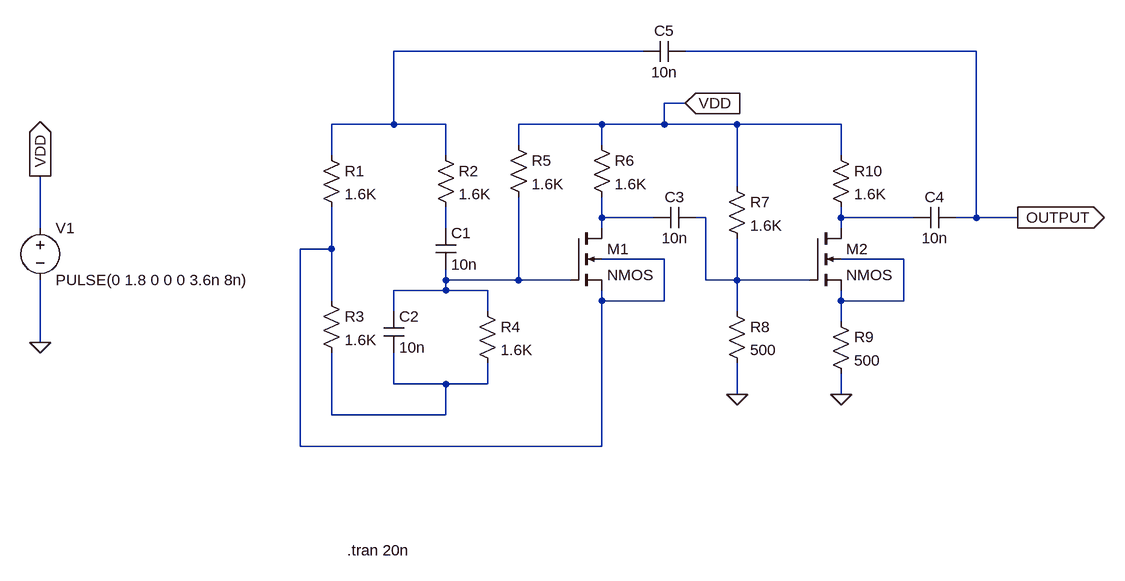
[diagram p0: schematic wein_osc.asc]
wein_osc.asc, the LTspice schematic file:
Version 4
SHEET 1 924 784
WIRE 192 0 -192 0
WIRE 704 0 256 0
WIRE 256 80 224 80
WIRE -192 112 -192 0
WIRE -192 112 -288 112
WIRE -112 112 -192 112
WIRE 128 112 0 112
WIRE 224 112 224 80
WIRE 224 112 128 112
WIRE 336 112 224 112
WIRE 496 112 336 112
WIRE 0 144 0 112
WIRE 128 144 128 112
WIRE -288 160 -288 112
WIRE -112 160 -112 112
WIRE 496 160 496 112
WIRE 336 208 336 112
WIRE 128 256 128 224
WIRE 208 256 128 256
WIRE 288 256 272 256
WIRE 496 256 496 240
WIRE 608 256 496 256
WIRE 704 256 704 0
WIRE 704 256 672 256
WIRE 768 256 704 256
WIRE -736 272 -736 192
WIRE -112 272 -112 240
WIRE 128 272 128 256
WIRE 496 272 496 256
WIRE -288 304 -288 240
WIRE -288 304 -336 304
WIRE 224 320 128 320
WIRE 592 320 496 320
WIRE -112 352 -112 336
WIRE 0 352 0 224
WIRE 0 352 -112 352
WIRE 80 352 0 352
WIRE 288 352 288 256
WIRE 336 352 336 288
WIRE 336 352 288 352
WIRE 448 352 336 352
WIRE -112 368 -112 352
WIRE -112 368 -192 368
WIRE -48 368 -112 368
WIRE -288 384 -288 304
WIRE 128 384 128 368
WIRE 224 384 224 320
WIRE 224 384 128 384
WIRE 496 384 496 368
WIRE 592 384 592 320
WIRE 592 384 496 384
WIRE -192 400 -192 368
WIRE -48 400 -48 368
WIRE 336 400 336 352
WIRE 496 416 496 384
WIRE -736 448 -736 352
WIRE -192 512 -192 464
WIRE -112 512 -192 512
WIRE -48 512 -48 480
WIRE -48 512 -112 512
WIRE 336 528 336 480
WIRE 496 528 496 496
WIRE -288 560 -288 464
WIRE -112 560 -112 512
WIRE -112 560 -288 560
WIRE -336 608 -336 304
WIRE 128 608 128 384
WIRE 128 608 -336 608
FLAG 336 528 0
FLAG 496 528 0
FLAG 768 256 OUTPUT
IOPIN 768 256 Out
FLAG 256 80 VDD
IOPIN 256 80 In
FLAG -736 448 0
FLAG -736 192 VDD
IOPIN -736 192 Out
SYMBOL res -304 144 R0
SYMATTR InstName R1
SYMATTR Value 1.6K
SYMBOL res -128 144 R0
SYMATTR InstName R2
SYMATTR Value 1.6K
SYMBOL res -304 368 R0
SYMATTR InstName R3
SYMATTR Value 1.6K
SYMBOL cap -128 272 R0
SYMATTR InstName C1
SYMATTR Value 10n
SYMBOL cap -208 400 R0
SYMATTR InstName C2
SYMATTR Value 10n
SYMBOL res -64 384 R0
SYMATTR InstName R4
SYMATTR Value 1.6K
SYMBOL res -16 128 R0
SYMATTR InstName R5
SYMATTR Value 1.6K
SYMBOL res 112 128 R0
SYMATTR InstName R6
SYMATTR Value 1.6K
SYMBOL nmos4 80 272 R0
SYMATTR InstName M1
SYMATTR Value2 l=180n w=360n
SYMBOL cap 272 240 R90
WINDOW 0 0 32 VBottom 2
WINDOW 3 32 32 VTop 2
SYMATTR InstName C3
SYMATTR Value 10n
SYMBOL res 320 192 R0
SYMATTR InstName R7
SYMATTR Value 1.6K
SYMBOL res 320 384 R0
SYMATTR InstName R8
SYMATTR Value 500
SYMBOL nmos4 448 272 R0
SYMATTR InstName M2
SYMATTR Value2 l=180n w=360n
SYMBOL res 480 400 R0
SYMATTR InstName R9
SYMATTR Value 500
SYMBOL res 480 144 R0
SYMATTR InstName R10
SYMATTR Value 1.6K
SYMBOL cap 672 240 R90
WINDOW 0 0 32 VBottom 2
WINDOW 3 32 32 VTop 2
SYMATTR InstName C4
SYMATTR Value 10n
SYMBOL cap 256 -16 R90
WINDOW 0 0 32 VBottom 2
WINDOW 3 32 32 VTop 2
SYMATTR InstName C5
SYMATTR Value 10n
SYMBOL voltage -736 256 R0
WINDOW 123 0 0 Left 0
WINDOW 39 0 0 Left 0
SYMATTR InstName V1
SYMATTR Value PULSE(0 1.8 0 0 0 3.6n 8n)
TEXT -264 768 Left 2 !.tran 20n

The netlist it stands for:
* wein_osc.asc
R1 N001 N006 1.6K
R2 N001 N005 1.6K
R3 N006 N009 1.6K
C1 N005 N008 10n
C2 N008 N009 10n
R4 N008 N009 1.6K
R5 VDD N008 1.6K
R6 VDD N002 1.6K
M1 N002 N008 N006 N006 NMOS l=180n w=360n
C3 N003 N002 10n
R7 VDD N003 1.6K
R8 N003 0 500
M2 N004 N003 N007 N007 NMOS l=180n w=360n
R9 N007 0 500
R10 VDD N004 1.6K
C4 OUTPUT N004 10n
C5 OUTPUT N001 10n
V1 VDD 0 PULSE(0 1.8 0 0 0 3.6n 8n)
.model NMOS NMOS
.model PMOS PMOS
.lib standard.mos
.tran 20n
.backanno
.end

* Results of the author's LTspice run, read from the files saved beside the schematic
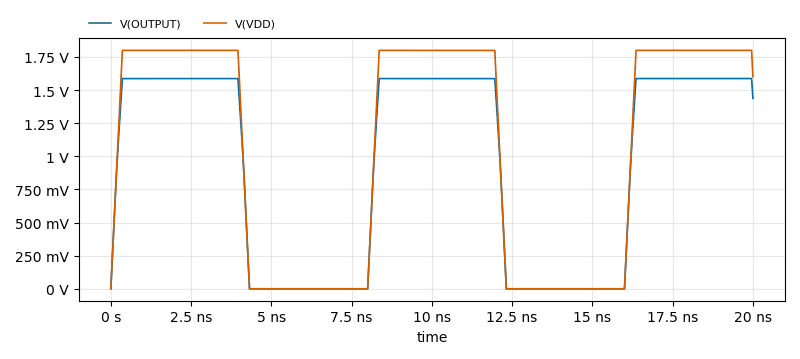
[diagram p1: Transient Analysis of wein_osc.asc, plotted from the saved traces]
* Transient Analysis, 1 run:
*   V(OUTPUT): min -35.51 µV, max 1.587 V, average 936.1 mV, rms 1.203 V, last 1.438 V
*   V(VDD): min 0 V, max 1.8 V, average 1.056 V, rms 1.361 V, last 1.6 V